# EAGLE design light_emitter (EAGLE 7.7.0)
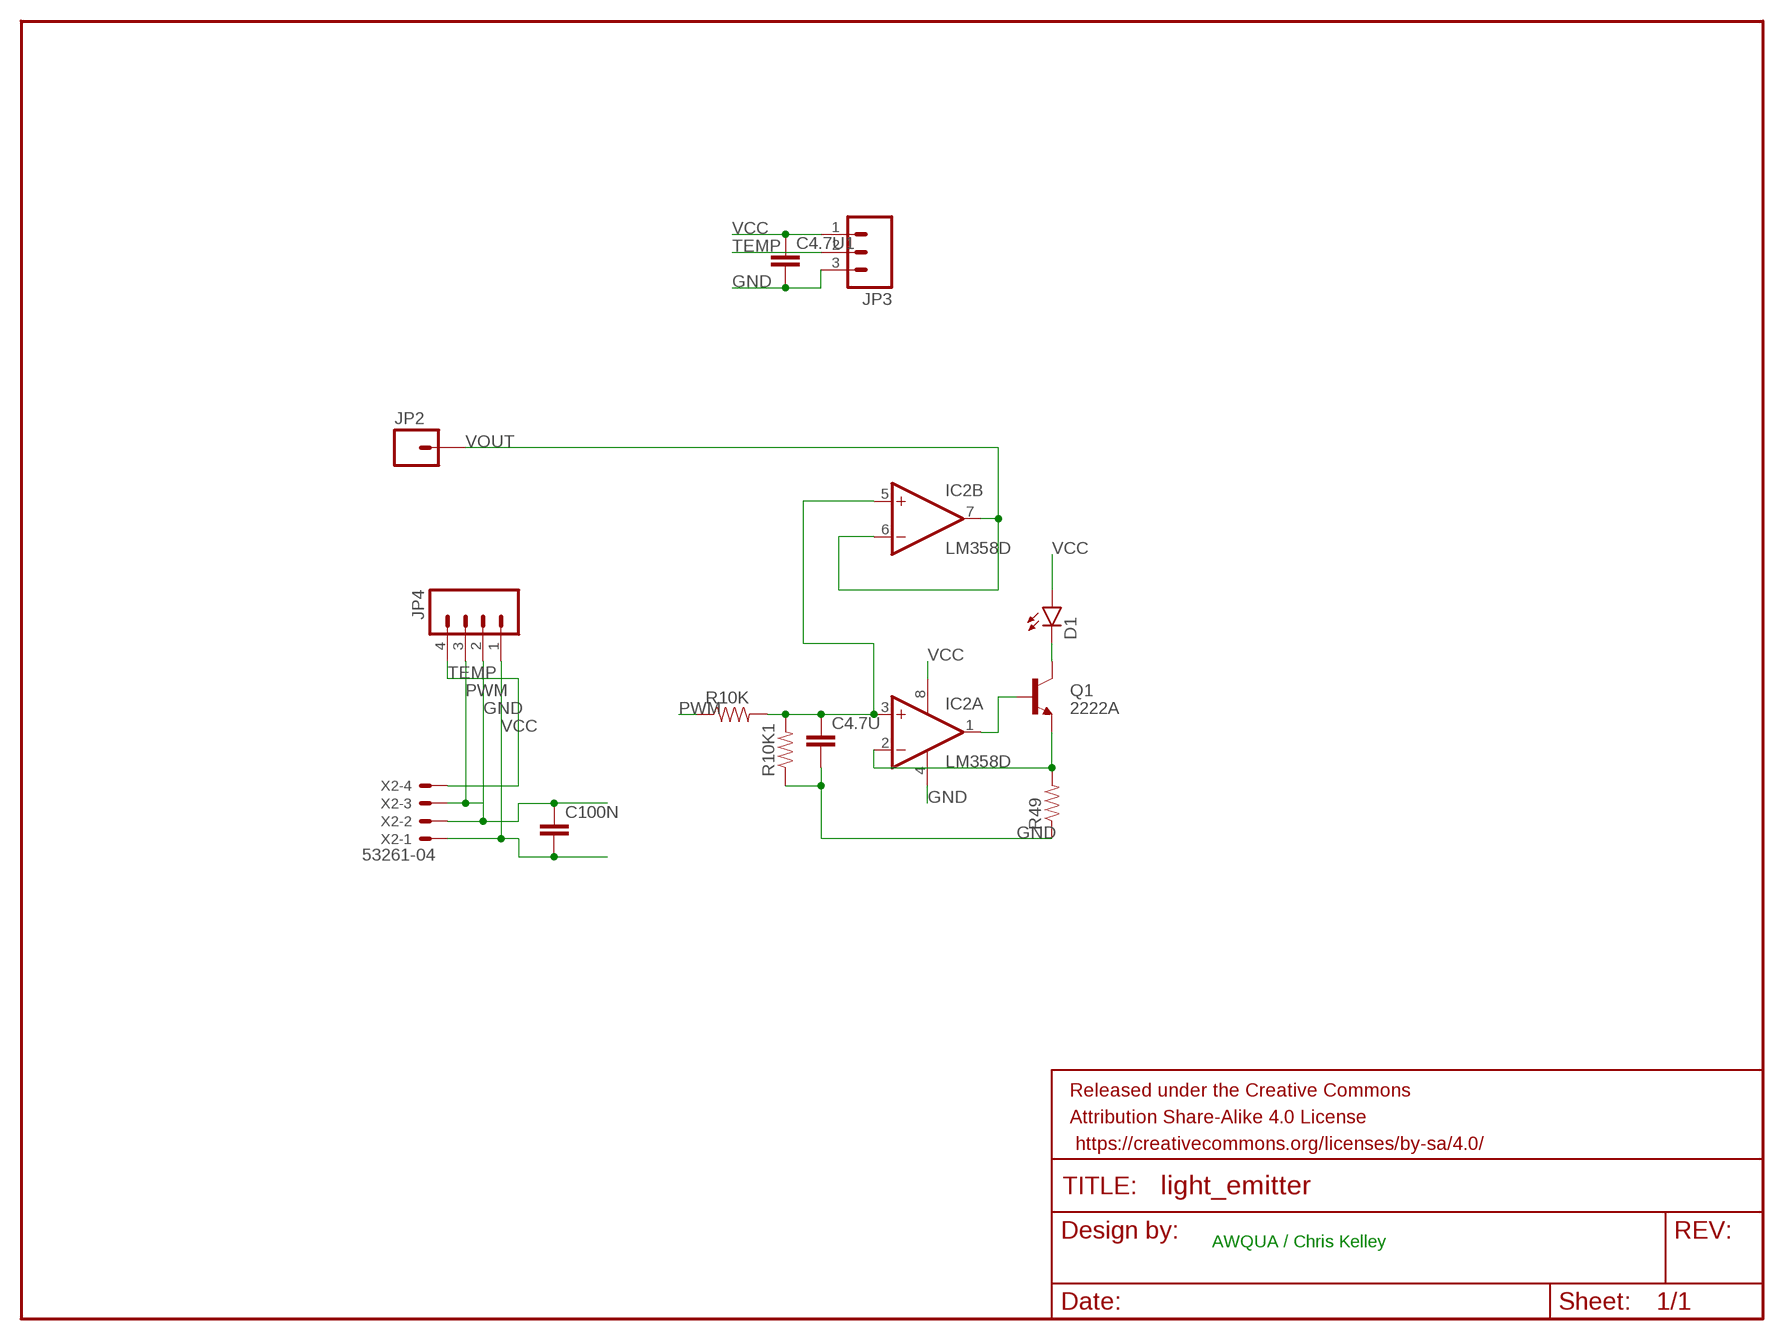
[diagram p0: schematic, sheet 1]

## Parts
C4.7U  CAP0603-CAP  [0603-CAP]
C4.7U1  CAP0603-CAP  [0603-CAP]
C100N  CAP0603-CAP  [0603-CAP]
D1  LED5MM  [LED5MM]
FRAME1  FRAME-LETTER  [CREATIVE_COMMONS]
IC2  LM358D  [SO08]
JP2  M01PTH  [1X01]
JP3  M03PTH  [1X03]
JP4  M04PTH  [1X04]
Q1  2222A  TRANSISTOR_NPNMMBT2222A  [SOT23-3]
R10K  RESISTOR0603-RES  [0603-RES]
R10K1  RESISTOR0603-RES  [0603-RES]
R49  RESISTOR0603-RES  [0603-RES]
X2  53261-04  [53261-04]

## Nets
GND: C4.7U1.2 C4.7U.2 C100N.1 IC2.4(P:V-) JP3.3 JP4.2 R10K1.1 R49.1 X2.2
N$1: IC2.2(A:-IN) Q1.2(E) R49.2
N$7: IC2.1(A:OUT) Q1.1(B)
N$9: D1.K(C) Q1.3(C)
PWM: JP4.3 R10K.1 X2.3
TEMP: JP3.2 JP4.4 X2.4
VCC: C4.7U1.1 C100N.2 D1.A IC2.8(P:V+) JP3.1 JP4.1 X2.1
VOUT: IC2.6(B:-IN) IC2.7(B:OUT) JP2.1
VOUT_PREBUF: C4.7U.1 IC2.3(A:+IN) IC2.5(B:+IN) R10K1.2 R10K.2

## Notes on the sheet
- AWQUA / Chris Kelley

## Library data of the parts
C4.7U C4.7U1 C100N = SparkFun-Passives:CAP: Capacitor Standard 0603 ceramic capacitor, and 0.1" leaded capacitor.
D1 = SparkFun-LED:LED: LEDs Standard schematic elements and footprints for 5mm, 3mm, 1206, and 0603 sized LEDs. 5mm - Spark Fun Electronics SKU : COM-00529 (and others)
FRAME1 = SparkFun-Aesthetics:FRAME-LETTER: Schematic Frame Standard 8.5x11 US Letter frame
IC2 = linear:LM358: OP AMP also LM158; LM258; LM2904 Source: http://cache.national.com/ds/LM/LM158.pdf
JP2 = SparkFun-Connectors:M01: Header 1 Standard 1-pin 0.1" header. Use with straight break away headers (SKU : PRT-00116), right angle break away headers (PRT-00553), swiss pins (PRT-00743), machine pins (PRT-00117), and female headers (PRT-00115).
JP3 = SparkFun-Connectors:M03: Header 3 Standard 3-pin 0.1" header. Use with straight break away headers (SKU : PRT-00116), right angle break away headers (PRT-00553), swiss pins (PRT-00743), machine pins (PRT-00117), and female headers (PRT-00115). Molex polarized connector foot print use with SKU : PRT-08232 with associated crimp pins and housings.
JP4 = SparkFun-Connectors:M04: Header 4 Standard 4-pin 0.1" header. Use with straight break away headers (SKU : PRT-00116), right angle break away headers (PRT-00553), swiss pins (PRT-00743), machine pins (PRT-00117), and female headers (PRT-00115). Molex polarized connector foot print use with SKU : PRT-08231 with associated crimp pins and housings. 1MM SMD Version SKU: PRT-10208
Q1 = SparkFun-DiscreteSemi:TRANSISTOR_NPN: Generic NPN BJT MMBT2222A - TRANS-08049 (SOT-23, 1A 40V) MPSA42 - TRANS-09116 (SOT-23, 500mA 300V) MMBT5088LT1G - TRANS-11160 (SOT-23, 50 mA 30V) BC547 - COM-08928 <http://www.sparkfun.com/products/8928> (TO-92 45V 100mA) (1.Collector 2.Base 3.Emitter) 2N3904 - COM-00521 <http://www.sparkfun.com/products/521> (TO-92 40V 200mA) (1.Emitter 2.Base 3.Collector) P2N2222A - COM-12852 <http://www.sparkfun.com/products/12852> (TO-92 40V 600mA) (1.Collector 2.Base 3.Emitter); PROD_ID: TRANS-08049; VALUE: MMBT2222A
R10K R10K1 R49 = SparkFun-Passives:RESISTOR: Resistor Basic schematic elements and footprints for 0603, 1206, and PTH resistors.
X2 = con-molex:53?-04: CONNECTOR wire to board 1.25 mm (.049 inch) pitch header; OC_FARNELL: 1125374; OC_NEWARK: unknown

## Board
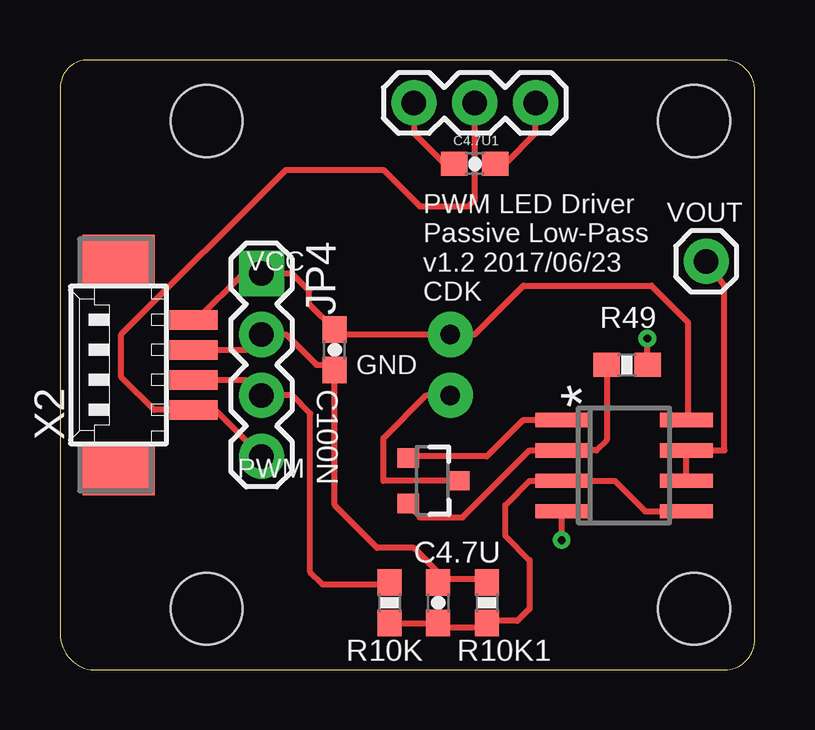
[diagram p1: board, top side]
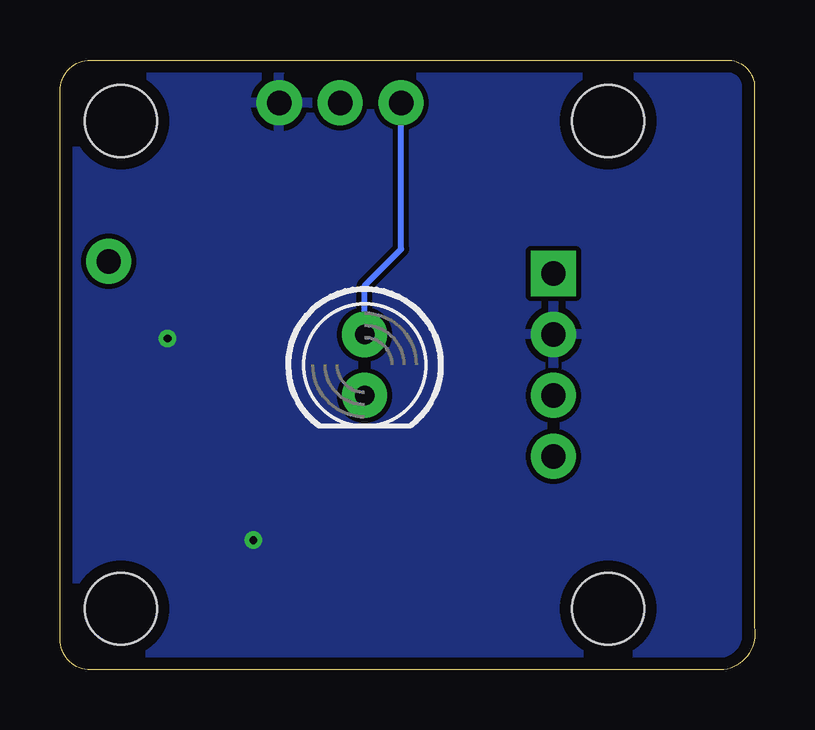
[diagram p2: board, bottom side, seen from below]

Size 28.98 x 25.41 mm. Coordinates in mm from the lower left corner, seen from the top.
Outline: 0.02,24.38 0.02,1.78 arc90 1.29,0 27.71,0 arc90 28.98,1.27 28.98,24.13 arc90 27.71,25.4 1.29,25.4 arc90 0.02,24.38
Copper layers (1*16): Top 0.035mm / dielectric 1.5mm / Bottom 0.035mm
Design rules "default *": minimum track width 10mil, minimum drill 24mil, track to track 8mil, track to pad 8mil, pad to pad 8mil, via to via 8mil, smd to smd 8mil, copper to edge 20mil, drill to drill 8mil, minimum pad ring 10mil, minimum via ring 8mil, stop-mask expansion 4mil, vias tented up to drill 13mil, thermal gap 10mil
Holes 3 mm at 6.12,22.86 26.44,22.86 26.44,2.54 6.12,2.54

### Footprints (pad centres in the part's own frame; a part is rotated, then mirrored left to right if it is on the bottom)
0603-CAP = smd 1.1 x 1: 1 -0.85,0; 2 0.85,0
LED5MM = drill 0.813 pad 1.88: A -1.27,0; K 1.27,0
SO08 = smd 0.6 x 2.2: 1 -1.905,-2.6; 2 -0.635,-2.6; 3 0.635,-2.6; 4 1.905,-2.6; 5 1.905,2.6; 6 0.635,2.6; 7 -0.635,2.6; 8 -1.905,2.6
1X01 = drill 1.016 pad 1.88: 1 0,0
1X03 = drill 1.016 pad 1.88: 1 0,0; 2 2.54,0; 3 5.08,0
1X04 = drill 1.016 pad 1.88 square: 1 0,0 | drill 1.016 pad 1.88: 2 2.54,0; 3 5.08,0; 4 7.62,0
SOT23-3 = smd 0.8 x 0.9: 1 -0.95,-1; 2 0.95,-1; 3 0,1.1
0603-RES = smd 1.1 x 1: 1 -0.85,0; 2 0.85,0
53261-04 = smd 0.8 x 2: 1 1.875,-2.5; 2 0.625,-2.5; 3 -0.625,-2.5; 4 -1.875,-2.5 | smd 2.1 x 3: S1 4.375,0.625; S2 -4.375,0.625

### Placement (x,y rotation side)
C4.7U  15.77,2.79 90 top
C4.7U1  17.29,21.08 0 top
C100N  11.45,13.34 90 top
D1  16.28,12.7 270 bottom
FRAME1  4.59,-14.61 0 top  (outside the outline)
IC2  23.52,8.51 270 top
JP2  26.94,17.02 0 top
JP3  14.75,23.62 0 top
JP4  8.4,16.51 270 top
Q1  15.51,7.87 270 top
R10K  13.74,2.79 270 top
R10K1  17.8,2.79 270 top
R49  23.64,12.7 180 top
X2  3.07,12.7 90 top

### Tracks (layer width: path | path; a pad name or v marks a point on that pad's centre or on a via)
GND  (via drill 0.33)
  Top 0.254: R49.1 v24.49,13.8 | R10K1.1 17.67,3.77 15.9,3.77 | IC2.4 v20.92,5.4 | 15.9,3.77 15.9,3.94 14.75,5.08 13.23,5.08 11.45,6.86 C100N.1 11.24,12.7 10.69,12.7 9.42,13.97 JP4.2 7.76,13.32 X2.2 | 15.9,3.77 C4.7U.2 | C4.7U1.2 18.56,21.08 19.83,22.35 JP3.3
  pour Bottom: -2.14,27.94 30.63,27.94 30.63,-1.14 -2.39,-1.14
N$1
  Top 0.254: Q1.2 14.51,6.84 15.01,6.35 16.78,6.35 19.58,9.14 IC2.2 | 20.15,9.14 IC2.2 | R49.2 22.79,9.56 22.37,9.14 IC2.2 | IC2.2 20.59,9.14
N$7
  Top 0.254: IC2.1 19.32,10.41 17.8,8.89 14.83,8.89 Q1.1
N$9
  Top 0.254: Q1.3 13.48,7.87 13.48,9.65 15.26,11.43 D1.K
PWM
  Top 0.254: 14.08,3.81 R10K.1 | 13.57,3.81 R10K.1 | R10K.1 13.65,3.56 10.94,3.56 10.43,4.06 10.43,10.67 9.67,11.43 JP4.3 7.76,12.07 X2.3
TEMP
  Top 0.254: JP4.4 6.47,10.82 X2.4 3.93,10.82 2.56,12.19 2.56,13.97 9.42,20.83 13.48,20.83 15.01,19.3 17.04,19.3 17.29,19.56 JP3.2
VCC
  Top 0.254: IC2.8 26.18,10.48 26.18,14.48 24.66,16 19.32,16 17.29,13.97 D1.A 11.74,13.97 C100N.2 10.4,15.24 10.4,15.79 9.67,16.51 JP4.1 7.64,16.51 5.71,14.57 X2.1 | JP3.1 14.75,22.35 16.02,21.08 C4.7U1.1
  Bottom 0.254: D1.A 16.28,16 14.75,17.53 JP3.1
VOUT
  Top 0.254: IC2.6 IC2.7 27.71,9.14 27.71,16 JP2.1
VOUT_PREBUF
  Top 0.254: R10K.2 C4.7U.1 15.77,1.78 17.8,1.78 R10K1.2 | R10K1.2 17.8,1.69 | IC2.5 24.4,6.6 23.13,7.87 IC2.3 19.58,7.87 18.56,6.86 18.56,5.59 19.58,4.57 19.58,2.54 19.07,2.03 17.89,2.03 R10K1.2

### Text on the board
tPlace: VOUT | VCC | PWM LED Driver / Passive Low-Pass / v1.2 2017/06/23 / CDK | GND | PWM
tNames: * | AWQUA / Chris Kelley